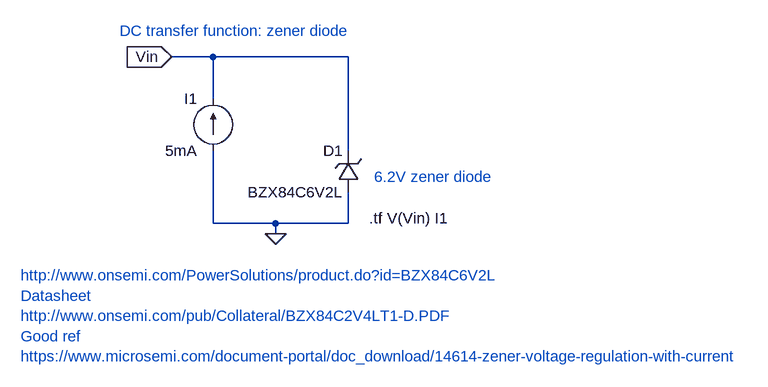
[diagram p0: schematic LTspice 03-4 tf3 zener diode.asc]
LTspice 03-4 tf3 zener diode.asc, the LTspice schematic file:
Version 4
SHEET 1 1520 680
WIRE 544 160 480 160
WIRE 752 160 544 160
WIRE 544 224 544 160
WIRE 752 304 752 160
WIRE 544 416 544 304
WIRE 640 416 544 416
WIRE 752 416 752 368
WIRE 752 416 640 416
WIRE 640 432 640 416
FLAG 640 432 0
FLAG 480 160 Vin
IOPIN 480 160 In
SYMBOL zener 768 368 R180
WINDOW 0 24 64 Left 2
WINDOW 3 24 0 Left 2
SYMATTR InstName D1
SYMATTR Value BZX84C6V2L
SYMATTR Description Diode
SYMATTR Type diode
SYMBOL current 544 304 R180
WINDOW 0 24 80 Left 2
WINDOW 3 24 0 Left 2
WINDOW 123 0 0 Left 2
WINDOW 39 0 0 Left 2
SYMATTR InstName I1
SYMATTR Value 5mA
TEXT 784 408 Left 2 !.tf V(Vin) I1
TEXT 400 120 Left 2 ;DC transfer function: zener diode
TEXT 792 344 Left 2 ;6.2V zener diode
TEXT 248 496 Left 2 ;http://www.onsemi.com/PowerSolutions/product.do?id=BZX84C6V2L\nDatasheet\nhttp://www.onsemi.com/pub/Collateral/BZX84C2V4LT1-D.PDF\nGood ref\nhttps://www.microsemi.com/document-portal/doc_download/14614-zener-voltage-regulation-with-current

The netlist it stands for:
* LTspice 03-4 tf3 zener diode.asc
D1 0 Vin BZX84C6V2L
I1 0 Vin 5mA
.model D D
.lib standard.dio
.tf V(Vin) I1
* DC transfer function: zener diode
* 6.2V zener diode
* http://www.onsemi.com/PowerSolutions/product.do?id=BZX84C6V2L
* Datasheet
* http://www.onsemi.com/pub/Collateral/BZX84C2V4LT1-D.PDF
* Good ref
* https://www.microsemi.com/document-portal/doc_download/14614-zener-voltage-regulation-with-current
.backanno
.end